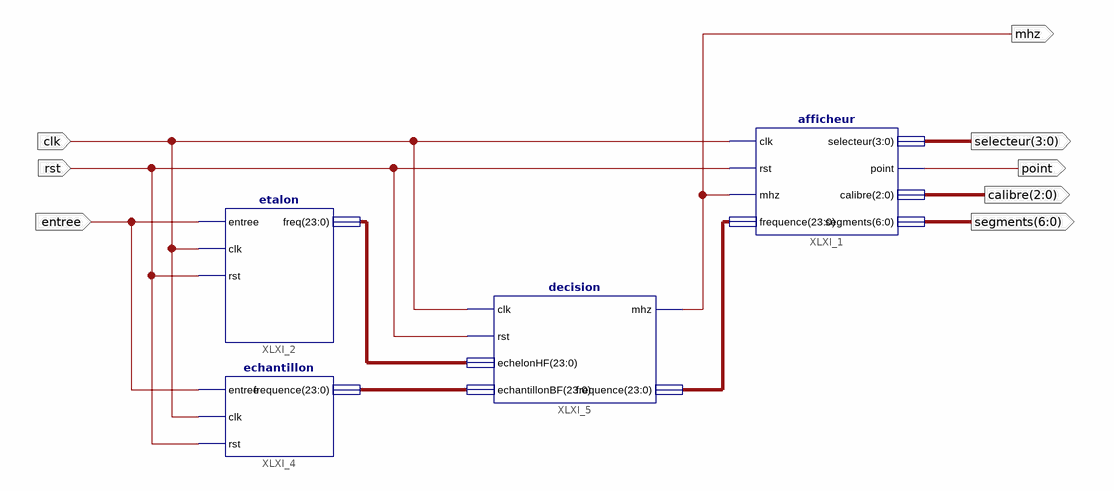
[diagram p0: schematic sheet 1]
// Xilinx ISE schematic frequencemetre.sch (spartan3e) as structural Verilog: 4 symbols, 8 ports
module frequencemetre (
  input  clk,
  input  entree,
  input  rst,
  output [3:0] selecteur,
  output point,
  output [2:0] calibre,
  output [6:0] segments,
  output mhz
);

  wire [23:0] XLXN_51, XLXN_52, XLXN_53;

  etalon XLXI_2 (.entree(entree), .clk(clk), .rst(rst), .freq(XLXN_51));
  echantillon XLXI_4 (.entree(entree), .clk(clk), .rst(rst), .frequence(XLXN_52));
  afficheur XLXI_1 (
    .clk(clk), .rst(rst), .mhz(mhz), .frequence(XLXN_53), .selecteur(selecteur), .point(point),
    .calibre(calibre), .segments(segments));
  decision XLXI_5 (.clk(clk), .rst(rst), .echelonHF(XLXN_51), .echantillonBF(XLXN_52), .mhz(mhz), .frequence(XLXN_53));
endmodule
